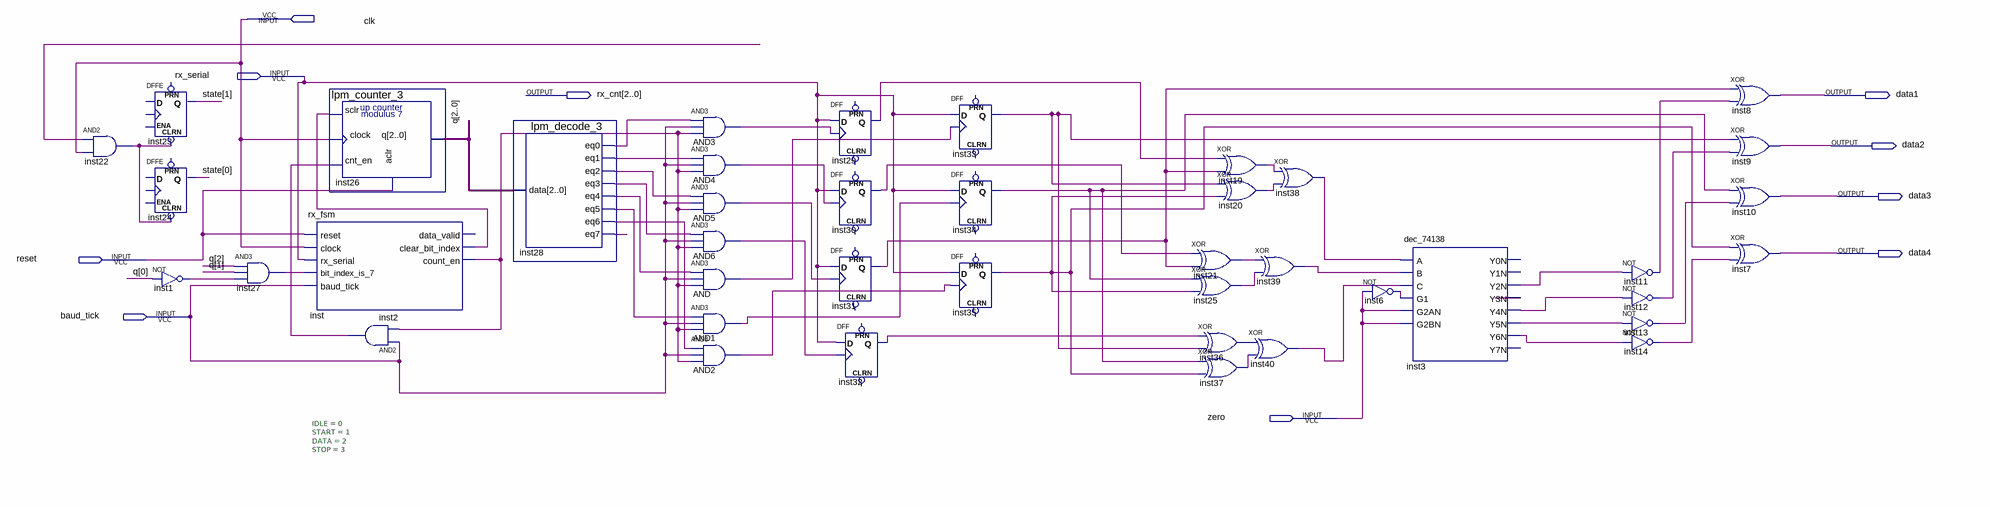
[diagram p0: schematic sheet]
// Quartus schematic rx.bdf as structural Verilog: 42 symbols, 10 pins
module rx (
  input  clk,
  input  rx_serial,
  input  reset,
  input  baud_tick,
  input  zero,
  output [2:0] rx_cnt,
  output data1,
  output data2,
  output data3,
  output data4
);

  wire AND1_out, AND2_out, AND3_out, AND4_out, AND5_out, AND6_out, AND_out, inst1_out, inst2_out, inst3_y2n,
       inst3_y3n, inst3_y4n, inst3_y5n, inst3_y6n, inst6_out, inst11_out, inst12_out, inst13_out, inst14_out,
       inst19_out, inst20_out, inst21_out, inst22_out, inst25_out, inst27_out, inst28_eq0, inst28_eq1,
       inst28_eq2, inst28_eq3, inst28_eq4, inst28_eq5, inst28_eq6, inst28_eq7, inst29_q, inst30_q, inst31_q,
       inst32_q, inst33_q, inst34_q, inst35_q, inst36_out, inst37_out, inst38_out, inst39_out, inst40_out,
       inst_clear_bit_index, inst_count_en, undriven;
  wire [1:0] state;
  wire [2:0] q;

  and inst22 (inst22_out, undriven, clk);
  DFFE inst23 (.CLRN(inst22_out), .Q(state[1]));  // open: PRN, D, CLK, ENA
  DFFE inst24 (.CLRN(inst22_out), .Q(state[0]));  // open: PRN, D, CLK, ENA
  not inst1 (inst1_out, q[0]);
  and inst27 (inst27_out, q[2], q[1], inst1_out);
  lpm_counter_3 inst26 (.sclr(inst_clear_bit_index), .clock(clk), .cnt_en(inst2_out), .aclr(reset), .q(q));
  rx_fsm #(.IDLE(0), .START(1), .DATA(2), .STOP(3)) inst (
    .reset(reset), .clock(clk), .rx_serial(rx_serial), .bit_index_is_7(inst27_out), .baud_tick(baud_tick),
    .clear_bit_index(inst_clear_bit_index), .count_en(inst_count_en));  // open: data_valid
  and inst2 (inst2_out, baud_tick, inst_count_en);
  lpm_decode_3 inst28 (
    .data(q), .eq0(inst28_eq0), .eq1(inst28_eq1), .eq2(inst28_eq2), .eq3(inst28_eq3), .eq4(inst28_eq4),
    .eq5(inst28_eq5), .eq6(inst28_eq6), .eq7(inst28_eq7));
  and AND3 (AND3_out, inst28_eq0, baud_tick, inst_count_en);
  and AND4 (AND4_out, inst28_eq1, baud_tick, inst_count_en);
  and AND5 (AND5_out, inst28_eq2, baud_tick, inst_count_en);
  and AND6 (AND6_out, inst28_eq3, baud_tick, inst_count_en);
  and AND (AND_out, inst28_eq4, baud_tick, inst_count_en);
  and AND1 (AND1_out, inst28_eq5, baud_tick, inst_count_en);
  and AND2 (AND2_out, inst28_eq6, baud_tick, inst_count_en);
  DFF inst29 (.CLK(AND3_out), .D(rx_serial), .Q(inst29_q));  // open: CLRN, PRN
  DFF inst30 (.CLK(AND4_out), .D(rx_serial), .Q(inst30_q));  // open: CLRN, PRN
  DFF inst31 (.CLK(AND5_out), .D(rx_serial), .Q(inst31_q));  // open: CLRN, PRN
  DFF inst32 (.CLK(AND6_out), .D(rx_serial), .Q(inst32_q));  // open: CLRN, PRN
  DFF inst33 (.CLK(AND_out), .D(rx_serial), .Q(inst33_q));  // open: CLRN, PRN
  DFF inst34 (.CLK(AND1_out), .D(rx_serial), .Q(inst34_q));  // open: CLRN, PRN
  DFF inst35 (.CLK(AND2_out), .D(rx_serial), .Q(inst35_q));  // open: CLRN, PRN
  xor inst21 (inst21_out, inst30_q, inst31_q);
  xor inst25 (inst25_out, inst34_q, inst35_q);
  xor inst36 (inst36_out, inst32_q, inst33_q);
  xor inst37 (inst37_out, inst34_q, inst35_q);
  xor inst19 (inst19_out, inst29_q, inst31_q);
  xor inst20 (inst20_out, inst33_q, inst35_q);
  xor inst40 (inst40_out, inst36_out, inst37_out);
  xor inst38 (inst38_out, inst19_out, inst20_out);
  xor inst39 (inst39_out, inst21_out, inst25_out);
  dec_74138 inst3 (
    .A(inst38_out), .B(inst39_out), .C(inst40_out), .G1(inst6_out), .G2AN(zero), .G2BN(zero),
    .Y2N(inst3_y2n), .Y3N(inst3_y3n), .Y4N(inst3_y4n), .Y5N(inst3_y5n), .Y6N(inst3_y6n));  // open: Y0N, Y1N, Y7N
  not inst6 (inst6_out, zero);
  not inst11 (inst11_out, inst3_y2n);
  not inst12 (inst12_out, inst3_y4n);
  not inst13 (inst13_out, inst3_y5n);
  not inst14 (inst14_out, inst3_y6n);
  xor inst8 (data1, inst31_q, inst11_out);
  xor inst9 (data2, inst33_q, inst12_out);
  xor inst10 (data3, inst34_q, inst13_out);
  xor inst7 (data4, inst35_q, inst14_out);
endmodule
